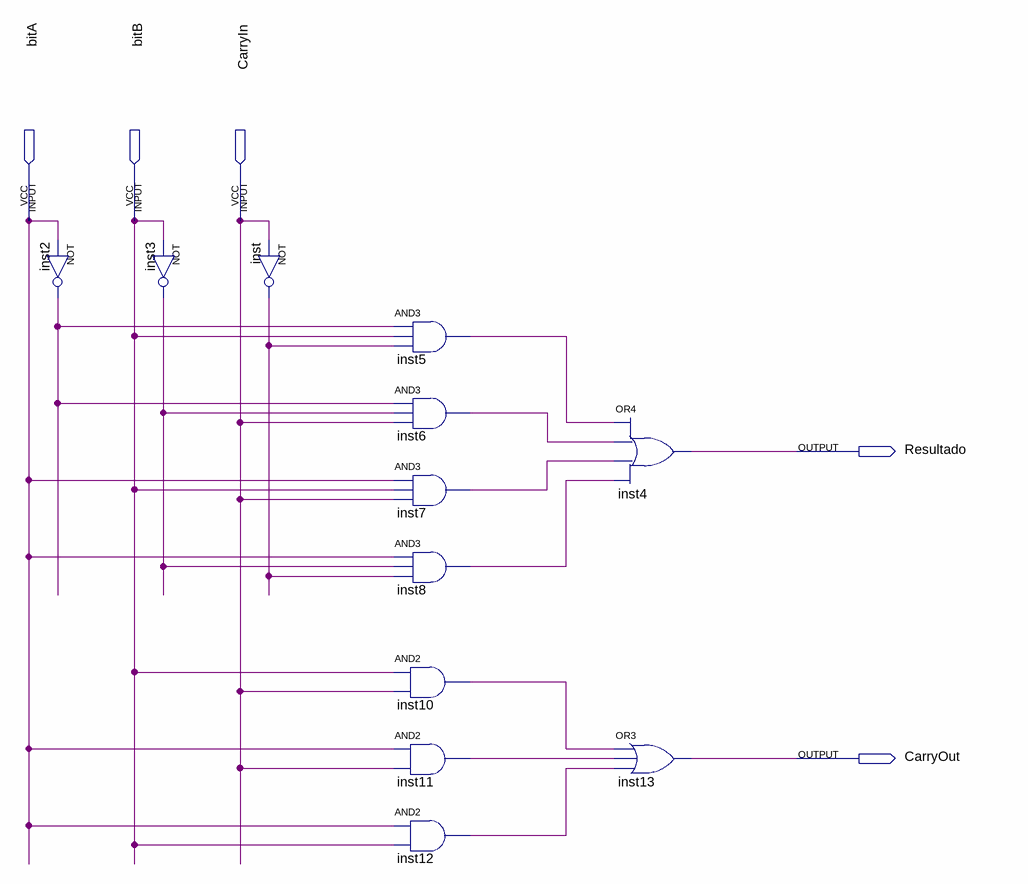
[diagram p0: schematic sheet]
// Quartus schematic FullAdder.bdf as structural Verilog: 12 symbols, 5 pins
module FullAdder (
  input  bitA,
  input  bitB,
  input  CarryIn,
  output Resultado,
  output CarryOut
);

  wire inst2_out, inst3_out, inst5_out, inst6_out, inst7_out, inst8_out, inst10_out, inst11_out, inst12_out,
       inst_out;

  not inst2 (inst2_out, bitA);
  not inst3 (inst3_out, bitB);
  not inst (inst_out, CarryIn);
  and inst5 (inst5_out, inst2_out, bitB, inst_out);
  and inst6 (inst6_out, inst2_out, inst3_out, CarryIn);
  and inst7 (inst7_out, bitA, bitB, CarryIn);
  and inst8 (inst8_out, bitA, inst3_out, inst_out);
  and inst10 (inst10_out, bitB, CarryIn);
  and inst11 (inst11_out, bitA, CarryIn);
  and inst12 (inst12_out, bitA, bitB);
  or inst4 (Resultado, inst5_out, inst6_out, inst7_out, inst8_out);
  or inst13 (CarryOut, inst10_out, inst11_out, inst12_out);
endmodule
